# EAGLE schematic wheel_encoder (EAGLE 7.6.0)
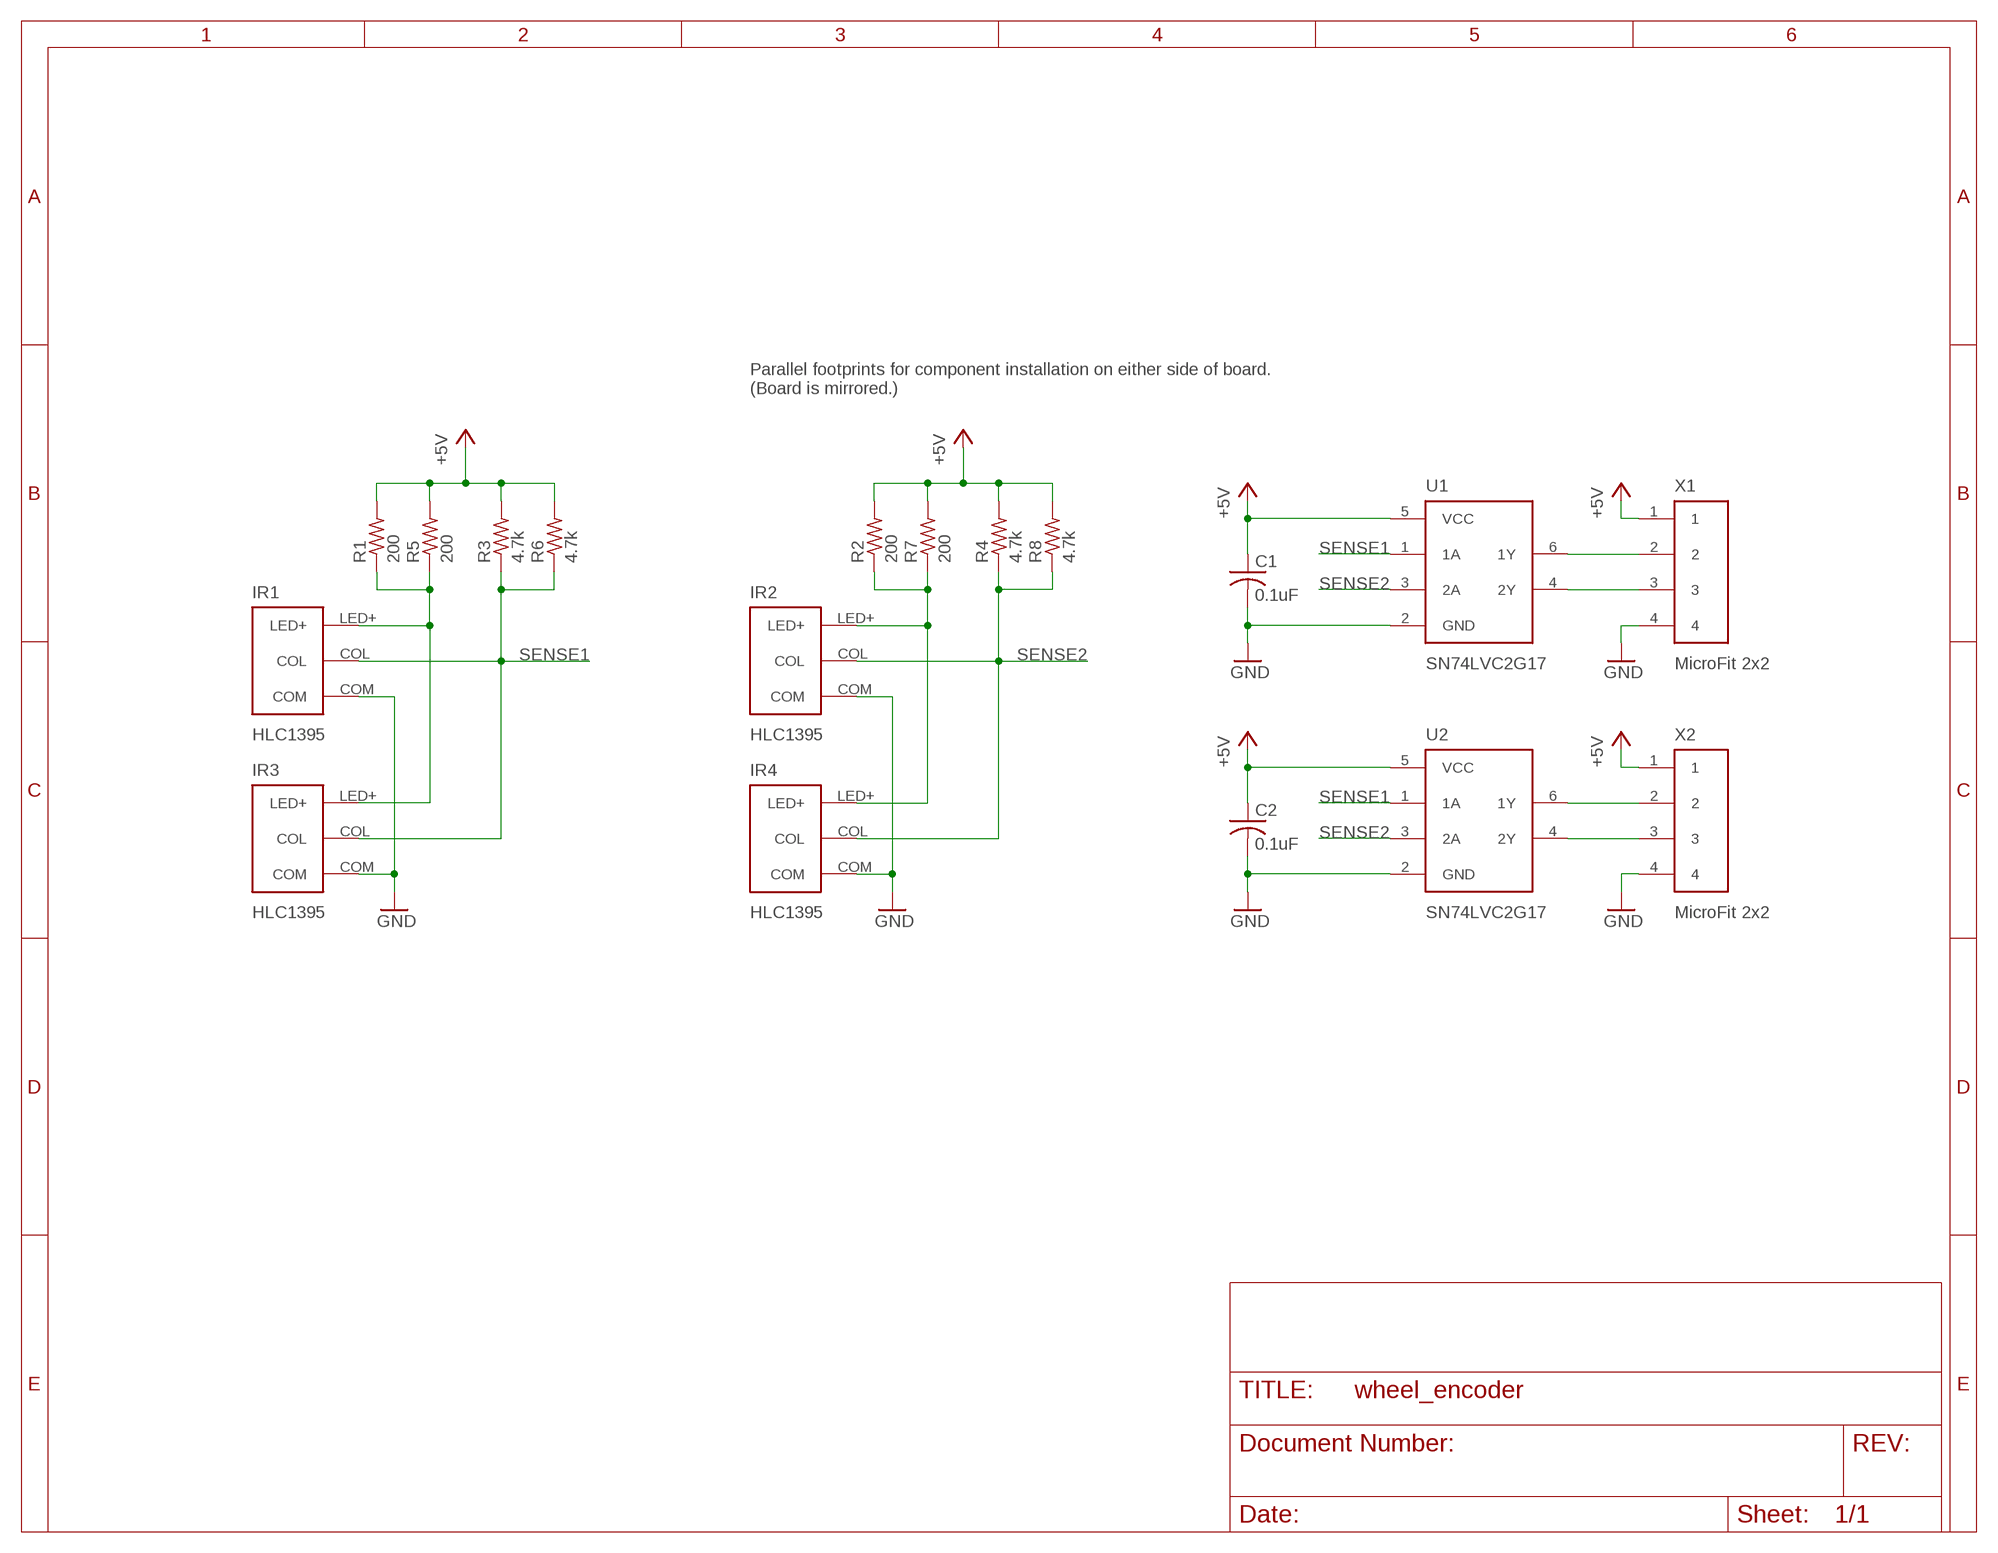
[diagram p0: schematic, sheet 1]

## Parts
C1  0.1uF  C-USC0603  [C0603]
C2  0.1uF  C-USC0603  [C0603]
IR1  HLC1395  [HLC1395]
IR2  HLC1395  [HLC1395]
IR3  HLC1395  [HLC1395]
IR4  HLC1395  [HLC1395]
R1  200  R-US_R0603  [R0603]
R2  200  R-US_R0603  [R0603]
R3  4.7k  R-US_R0603  [R0603]
R4  4.7k  R-US_R0603  [R0603]
R5  200  R-US_R0603  [R0603]
R6  4.7k  R-US_R0603  [R0603]
R7  200  R-US_R0603  [R0603]
R8  4.7k  R-US_R0603  [R0603]
U1  SN74LVC2G17DBVR  [SOT-23-6]
U2  SN74LVC2G17DBVR  [SOT-23-6]
X1  MICROFIT-2X2-SMD  [MICROFIT-2X2-0430450411]
X2  MICROFIT-2X2-SMD  [MICROFIT-2X2-0430450411]

## Nets
+5V: C1.1 C2.1 R1.2 R2.2 R3.2 R4.2 R5.2 R6.2 R7.2 R8.2 U1.5(VCC) U2.5(VCC) X1.1 X2.1
GND: C1.2 C2.2 IR1.COM IR2.COM IR3.COM IR4.COM U1.2(GND) U2.2(GND) X1.4 X2.4
N$1: IR1.LED+ IR3.LED+ R1.1 R5.1
N$2: IR2.LED+ IR4.LED+ R2.1 R7.1
N$4: U1.4(2Y) X1.3
N$5: U1.6(1Y) X1.2
N$9: U2.6(1Y) X2.2
N$10: U2.4(2Y) X2.3
SENSE1: IR1.COL IR3.COL R3.1 R6.1 U1.1(1A) U2.1(1A)
SENSE2: IR2.COL IR4.COL R4.1 R8.1 U1.3(2A) U2.3(2A)

## Notes on the sheet
- Parallel footprints for component installation on either side of board.
  (Board is mirrored.)

## Library data of the parts
C1 C2 = resistor:C-US: CAPACITOR, American symbol
IR1-IR4 = rover12:HLC1395
R1-R8 = resistor:R-US_: RESISTOR, American symbol
U1 U2 = rover12:SN74LVC2G17DBVR
X1 X2 = rover12:MICROFIT-2X2-SMD